# EAGLE design PygmyETX_v1p01 (EAGLE 5.11)

## Sheet 1 of 5
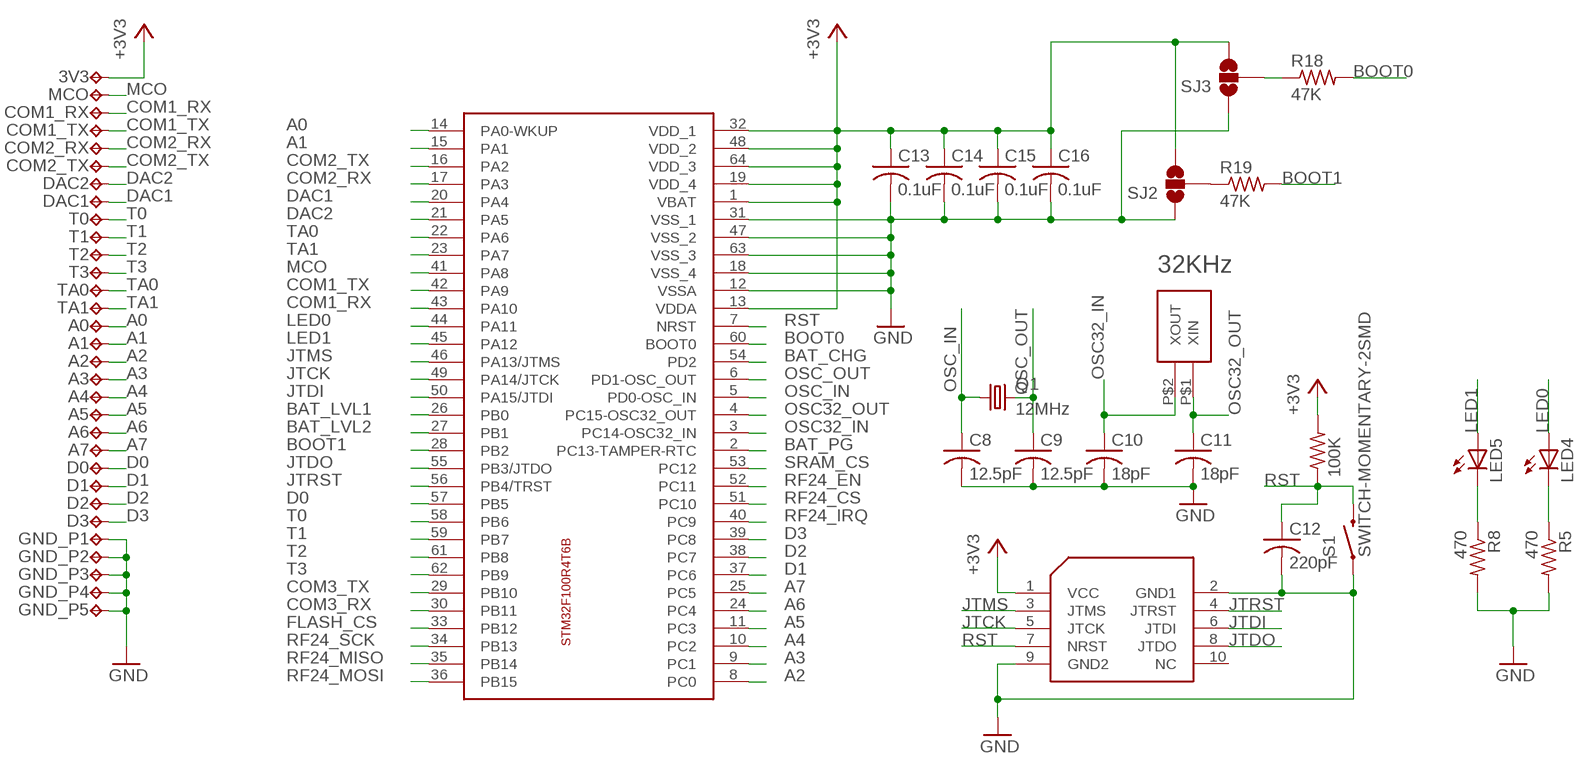
[diagram p0: schematic, sheet 1]

### Parts
3V3  TESTPAD_TPTESTPAD_PTH_STD  [TESTPAD_PTH_STD]
A0  TESTPAD_TPTESTPAD_PTH_STD  [TESTPAD_PTH_STD]
A1  TESTPAD_TPTESTPAD_PTH_STD  [TESTPAD_PTH_STD]
A2  TESTPAD_TPTESTPAD_PTH_STD  [TESTPAD_PTH_STD]
A3  TESTPAD_TPTESTPAD_PTH_STD  [TESTPAD_PTH_STD]
A4  TESTPAD_TPTESTPAD_PTH_STD  [TESTPAD_PTH_STD]
A5  TESTPAD_TPTESTPAD_PTH_STD  [TESTPAD_PTH_STD]
A6  TESTPAD_TPTESTPAD_PTH_STD  [TESTPAD_PTH_STD]
A7  TESTPAD_TPTESTPAD_PTH_STD  [TESTPAD_PTH_STD]
C8  12.5pF  C-USC0402  [C0402]
C9  12.5pF  C-USC0402  [C0402]
C10  18pF  C-USC0402  [C0402]
C11  18pF  C-USC0402  [C0402]
C12  220pF  C-USC0402  [C0402]
C13  0.1uF  C-USC0402  [C0402]
C14  0.1uF  C-USC0402  [C0402]
C15  0.1uF  C-USC0402  [C0402]
C16  0.1uF  C-USC0402  [C0402]
COM1_RX  TESTPAD_TPTESTPAD_PTH_STD  [TESTPAD_PTH_STD]
COM1_TX  TESTPAD_TPTESTPAD_PTH_STD  [TESTPAD_PTH_STD]
COM2_RX  TESTPAD_TPTESTPAD_PTH_STD  [TESTPAD_PTH_STD]
COM2_TX  TESTPAD_TPTESTPAD_PTH_STD  [TESTPAD_PTH_STD]
D0  TESTPAD_TPTESTPAD_PTH_STD  [TESTPAD_PTH_STD]
D1  TESTPAD_TPTESTPAD_PTH_STD  [TESTPAD_PTH_STD]
D2  TESTPAD_TPTESTPAD_PTH_STD  [TESTPAD_PTH_STD]
D3  TESTPAD_TPTESTPAD_PTH_STD  [TESTPAD_PTH_STD]
DAC1  TESTPAD_TPTESTPAD_PTH_STD  [TESTPAD_PTH_STD]
DAC2  TESTPAD_TPTESTPAD_PTH_STD  [TESTPAD_PTH_STD]
GND_P1  TESTPAD_TPTESTPAD_PTH_STD  [TESTPAD_PTH_STD]
GND_P2  TESTPAD_TPTESTPAD_PTH_STD  [TESTPAD_PTH_STD]
GND_P3  TESTPAD_TPTESTPAD_PTH_STD  [TESTPAD_PTH_STD]
GND_P4  TESTPAD_TPTESTPAD_PTH_STD  [TESTPAD_PTH_STD]
GND_P5  TESTPAD_TPTESTPAD_PTH_STD  [TESTPAD_PTH_STD]
LED4  LED0603  [LED-0603]
LED5  LED0603  [LED-0603]
MCO  TESTPAD_TPTESTPAD_PTH_STD  [TESTPAD_PTH_STD]
Q1  12MHz  CRYSTAL5X3  [CRYSTAL-SMD-5X3]
Q2  CM415  [CM415]
R3  100K  R-US_R0402  [R0402]
R5  470  R-US_R0402  [R0402]
R8  470  R-US_R0402  [R0402]
R18  47K  R-US_R0402  [R0402]
R19  47K  R-US_R0402  [R0402]
S1  SWITCH-MOMENTARY-2SMD  [TACTILE_SWITCH_SMD]
SJ2  SOLDERJUMPER_2WAYPASTE1&2  [SJ_3_PASTE1&2]
SJ3  SOLDERJUMPER_2WAYPASTE1&2  [SJ_3_PASTE1&2]
T0  TESTPAD_TPTESTPAD_PTH_STD  [TESTPAD_PTH_STD]
T1  TESTPAD_TPTESTPAD_PTH_STD  [TESTPAD_PTH_STD]
T2  TESTPAD_TPTESTPAD_PTH_STD  [TESTPAD_PTH_STD]
T3  TESTPAD_TPTESTPAD_PTH_STD  [TESTPAD_PTH_STD]
TA0  TESTPAD_TPTESTPAD_PTH_STD  [TESTPAD_PTH_STD]
TA1  TESTPAD_TPTESTPAD_PTH_STD  [TESTPAD_PTH_STD]
U3  STM32F100R4T6B  [S-PQFP64-G64]
U$1  STM32-JTAG-10P  [STM32-JTAG-10P]

### Nets
+3V3: 3V3.P$1(TP) C13.1 C14.1 C15.1 C16.1 R3.2 SJ2.3 SJ3.3 U3.1(VBAT) U3.13(VDDA) U3.19(VDD_4) U3.32(VDD_1) U3.48(VDD_2) U3.64(VDD_3) U$1.1(VCC) ; also sheet 2,3,5
A0: A0.P$1(TP) U3.14(PA0-WKUP)
A1: A1.P$1(TP) U3.15(PA1)
A2: A2.P$1(TP) U3.8(PC0)
A3: A3.P$1(TP) U3.9(PC1)
A4: A4.P$1(TP) U3.10(PC2)
A5: A5.P$1(TP) U3.11(PC3)
A6: A6.P$1(TP) U3.24(PC4)
A7: A7.P$1(TP) U3.25(PC5)
BAT_CHG: U3.54(PD2) ; also sheet 3
BAT_LVL1: U3.26(PB0) ; also sheet 3
BAT_LVL2: U3.27(PB1) ; also sheet 3
BAT_PG: U3.2(PC13-TAMPER-RTC) ; also sheet 3
BOOT0: R18.2 U3.60(BOOT0)
BOOT1: R19.2 U3.28(PB2)
COM1_RX: COM1_RX.P$1(TP) U3.43(PA10)
COM1_TX: COM1_TX.P$1(TP) U3.42(PA9)
COM2_RX: COM2_RX.P$1(TP) U3.17(PA3)
COM2_TX: COM2_TX.P$1(TP) U3.16(PA2)
COM3_RX: U3.30(PB11) ; also sheet 4
COM3_TX: U3.29(PB10) ; also sheet 4
D0: D0.P$1(TP) U3.57(PB5)
D1: D1.P$1(TP) U3.37(PC6)
D2: D2.P$1(TP) U3.38(PC7)
D3: D3.P$1(TP) U3.39(PC8)
DAC1: DAC1.P$1(TP) U3.20(PA4)
DAC2: DAC2.P$1(TP) U3.21(PA5)
FLASH_CS: U3.33(PB12) ; also sheet 5
GND: C8.2 C9.2 C10.2 C11.2 C12.2 C13.2 C14.2 C15.2 C16.2 GND_P1.P$1(TP) GND_P2.P$1(TP) GND_P3.P$1(TP) GND_P4.P$1(TP) GND_P5.P$1(TP) R5.2 R8.2 S1.1 SJ2.1 SJ3.1 U3.12(VSSA) U3.18(VSS_4) U3.31(VSS_1) U3.47(VSS_2) U3.63(VSS_3) U$1.2(GND1) U$1.9(GND2) ; also sheet 2,3,4,5
JTCK: U3.49(PA14/JTCK) U$1.5(JTCK)
JTDI: U3.50(PA15/JTDI) U$1.6(JTDI)
JTDO: U3.55(PB3/JTDO) U$1.8(JTDO)
JTMS: U3.46(PA13/JTMS) U$1.3(JTMS)
JTRST: U3.56(PB4/TRST) U$1.4(JTRST)
LED0: LED4.A U3.44(PA11)
LED1: LED5.A U3.45(PA12)
MCO: MCO.P$1(TP) U3.41(PA8)
N$31: R18.1 SJ3.2
N$33: R19.1 SJ2.2
N$35: LED5.C R8.1
N$37: LED4.C R5.1
OSC32_IN: C10.1 Q2.P$2(XOUT) U3.3(PC14-OSC32_IN)
OSC32_OUT: C11.1 Q2.P$1(XIN) U3.4(PC15-OSC32_OUT)
OSC_IN: C8.1 Q1.1 U3.5(PD0-OSC_IN)
OSC_OUT: C9.1 Q1.3 U3.6(PD1-OSC_OUT)
RF24_CS: U3.51(PC10) ; also sheet 2
RF24_EN: U3.52(PC11) ; also sheet 2
RF24_IRQ: U3.40(PC9) ; also sheet 2
RF24_MISO: U3.35(PB14) ; also sheet 2,5
RF24_MOSI: U3.36(PB15) ; also sheet 2,5
RF24_SCK: U3.34(PB13) ; also sheet 2,5
RST: C12.1 R3.1 S1.3 U3.7(NRST) U$1.7(NRST)
SRAM_CS: U3.53(PC12) ; also sheet 5
T0: T0.P$1(TP) U3.58(PB6)
T1: T1.P$1(TP) U3.59(PB7)
T2: T2.P$1(TP) U3.61(PB8)
T3: T3.P$1(TP) U3.62(PB9)
TA0: TA0.P$1(TP) U3.22(PA6)
TA1: TA1.P$1(TP) U3.23(PA7)
Unconnected: U$1.10(NC)

## Sheet 2 of 5
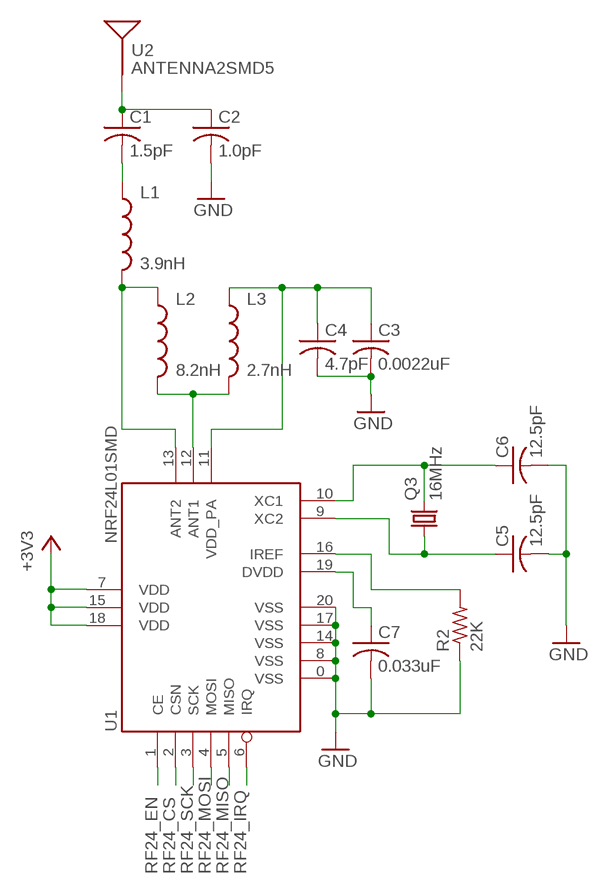
[diagram p1: schematic, sheet 2]

### Parts
C1  1.5pF  C-USC0402  [C0402]
C2  1.0pF  C-USC0402  [C0402]
C3  0.0022uF  C-USC0402  [C0402]
C4  4.7pF  C-USC0402  [C0402]
C5  12.5pF  C-USC0402  [C0402]
C6  12.5pF  C-USC0402  [C0402]
C7  0.033uF  C-USC0402  [C0402]
L1  3.9nH  INDUCTOR0402  [C0402]
L2  8.2nH  INDUCTOR0402  [C0402]
L3  2.7nH  INDUCTOR0402  [C0402]
Q3  16MHz  CRYSTAL5X3  [CRYSTAL-SMD-5X3]
R2  22K  R-US_R0402  [R0402]
U1  NRF24L01SMD  [QFN20]
U2  ANTENNA2SMD5  [ANTENNA-CHIP5]

### Nets
+3V3: U1.7(VDD) U1.15(VDD) U1.18(VDD) ; also sheet 1,3,5
GND: C2.2 C3.2 C4.2 C5.2 C6.2 C7.2 R2.1 U1.0(VSS) U1.8(VSS) U1.14(VSS) U1.17(VSS) U1.20(VSS) ; also sheet 1,3,4,5
N$1: C1.1 C2.1 U2.FEED(SIGNAL)
N$2: C1.2 L1.1
N$3: L1.2 L2.1 U1.13(ANT2)
N$4: L2.2 L3.2 U1.12(ANT1)
N$5: C3.1 C4.1 L3.1 U1.11(VDD_PA)
N$7: C6.1 Q3.3 U1.10(XC1)
N$8: C5.1 Q3.1 U1.9(XC2)
N$10: R2.2 U1.16(IREF)
N$11: C7.1 U1.19(DVDD)
RF24_CS: U1.2(CSN) ; also sheet 1
RF24_EN: U1.1(CE) ; also sheet 1
RF24_IRQ: U1.6(IRQ) ; also sheet 1
RF24_MISO: U1.5(MISO) ; also sheet 1,5
RF24_MOSI: U1.4(MOSI) ; also sheet 1,5
RF24_SCK: U1.3(SCK) ; also sheet 1,5

## Sheet 3 of 5
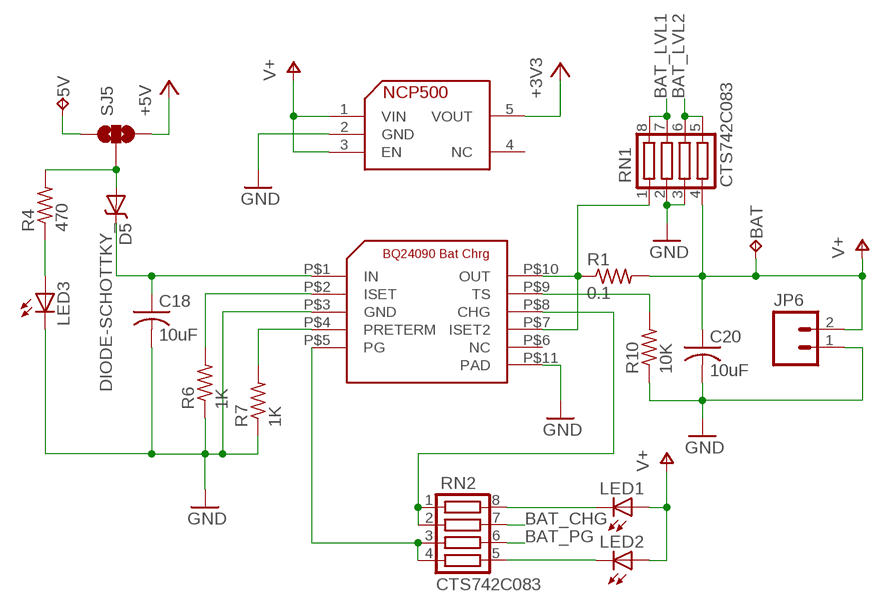
[diagram p2: schematic, sheet 3]

### Parts
5V  TESTPAD_TPTESTPAD_PTH_STD  [TESTPAD_PTH_STD]
BAT  TESTPAD_TPTESTPAD_PTH_STD  [TESTPAD_PTH_STD]
C18  10uF  C-USC1206  [C1206]
C20  10uF  C-USC1206  [C1206]
D5  DIODE-SCHOTTKY_  [SMA-DIODE]
JP6  M02-JST-2MM-SMT  [JST-2-SMD]
LED1  LED0603  [LED-0603]
LED2  LED0603  [LED-0603]
LED3  LED0603  [LED-0603]
R1  0.1  R-US_R0805  [R0805]
R4  470  R-US_R0402  [R0402]
R6  1K  R-US_R0402  [R0402]
R7  1K  R-US_R0402  [R0402]
R10  10K  R-US_R0402  [R0402]
RN1  CTS742C083  [CTS742C083]
RN2  CTS742C083  [CTS742C083]
SJ5  SOLDERJUMPER_2WAYPASTE1&2  [SJ_3_PASTE1&2]
U6  BQ24090  [R-PDSO-G10]
U8  NCP500  [SOT23-5L]

### Nets
+3V3: U8.5(VOUT) ; also sheet 1,2,5
+5V: SJ5.3 ; also sheet 4
BAT_CHG: RN2.7 ; also sheet 1
BAT_LVL1: RN1.7 RN1.8 ; also sheet 1
BAT_LVL2: RN1.5 RN1.6 ; also sheet 1
BAT_PG: RN2.6 ; also sheet 1
GND: C18.2 C20.2 JP6.1 LED3.C R6.1 R7.1 R10.1 RN1.2 RN1.3 U6.P$3(GND) U6.P$11(PAD) U8.2(GND) ; also sheet 1,2,4,5
N$6: C18.1 D5.C U6.P$1(IN)
N$9: 5V.P$1(TP) SJ5.1
N$12: R6.2 U6.P$2(ISET)
N$13: R7.2 U6.P$4(PRETERM)
N$14: RN2.3 RN2.4 U6.P$5(PG)
N$15: LED3.A R4.1
N$16: R1.1 RN1.1 U6.P$7(ISET2) U6.P$10(OUT)
N$17: RN2.1 RN2.2 U6.P$8(CHG)
N$18: R10.2 U6.P$9(TS)
N$20: LED2.C RN2.5
N$23: LED1.C RN2.8
N$25: D5.A R4.2 SJ5.2
V+: BAT.P$1(TP) C20.1 JP6.2 LED1.A LED2.A R1.2 RN1.4 U8.1(VIN) U8.3(EN)
Unconnected: U6.P$6(NC) U8.4(NC)

## Sheet 4 of 5
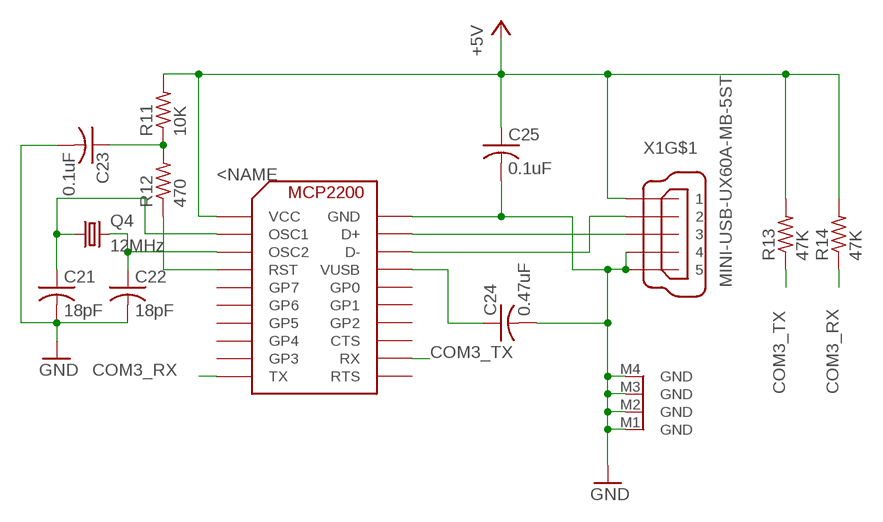
[diagram p3: schematic, sheet 4]

### Parts
C21  18pF  C-USC0402  [C0402]
C22  18pF  C-USC0402  [C0402]
C23  0.1uF  C-USC0402  [C0402]
C24  0.47uF  C-USC0402  [C0402]
C25  0.1uF  C-USC0402  [C0402]
Q4  12MHz  CRYSTAL5X3  [CRYSTAL-SMD-5X3]
R11  10K  R-US_R0402  [R0402]
R12  470  R-US_R0402  [R0402]
R13  47K  R-US_R0402  [R0402]
R14  47K  R-US_R0402  [R0402]
U7  MICROCHIP-USB-MCP2200  [QFN-20-5X5]
X1  MINI-USB-UX60A-MB-5ST  [UX60A-MB-5ST]

### Nets
+5V: C25.1 R11.2 R13.2 R14.2 U7.P18(VCC) X1.1 ; also sheet 3
COM3_RX: R14.1 U7.P7(TX) ; also sheet 1
COM3_TX: R13.1 U7.P9(RX) ; also sheet 1
GND: C21.2 C22.2 C23.2 C24.2 C25.2 U7.P17(GND) X1.4 X1.5 X1.M1(GND) X1.M2(GND) X1.M3(GND) X1.M4(GND) ; also sheet 1,2,3,5
N$19: C23.1 R11.1 R12.2
N$21: C22.1 Q4.3 U7.P20(OSC2)
N$22: C21.1 Q4.1 U7.P19(OSC1)
N$24: R12.1 U7.P1(RST)
N$26: U7.P15(D-) X1.2
N$28: C24.1 U7.P14(VUSB)
N$36: U7.P16(D+) X1.3
Unconnected: U7.P2(GP7) U7.P3(GP6) U7.P4(GP5) U7.P5(GP4) U7.P6(GP3) U7.P8(RTS) U7.P10(CTS) U7.P11(GP2) U7.P12(GP1) U7.P13(GP0)

## Sheet 5 of 5
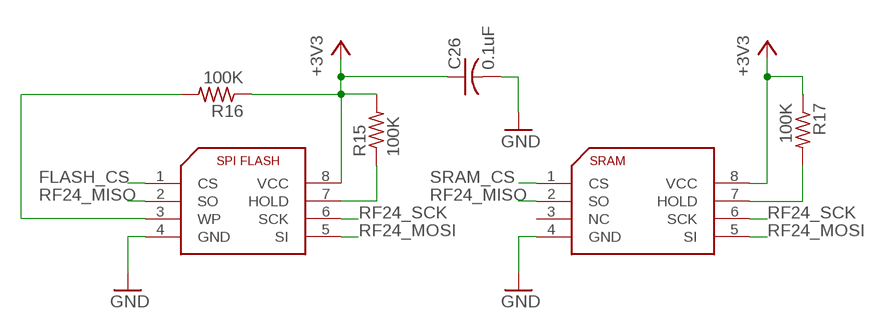
[diagram p4: schematic, sheet 5]

### Parts
C26  0.1uF  C-USC0402  [C0402]
R15  100K  R-US_R0402  [R0402]
R16  100K  R-US_R0402  [R0402]
R17  100K  R-US_R0402  [R0402]
U9  SST25VF080B  [SOIC8]
U10  N25S0830HA  [TSSOP8]

### Nets
+3V3: C26.1 R15.2 R16.1 R17.1 U9.8(VCC) U10.8(VCC) ; also sheet 1,2,3
FLASH_CS: U9.1(CS) ; also sheet 1
GND: C26.2 U9.4(GND) U10.4(GND) ; also sheet 1,2,3,4
N$27: R17.2 U10.7(HOLD)
N$30: R16.2 U9.3(WP)
N$32: R15.1 U9.7(HOLD)
RF24_MISO: U9.2(SO) U10.2(SO) ; also sheet 1,2
RF24_MOSI: U9.5(SI) U10.5(SI) ; also sheet 1,2
RF24_SCK: U9.6(SCK) U10.6(SCK) ; also sheet 1,2
SRAM_CS: U10.1(CS) ; also sheet 1
Unconnected: U10.3(NC)

## Library data of the parts
3V3 5V A0 A1-A7 BAT COM1_RX COM1_TX COM2_RX COM2_TX D0 D1-D3 DAC1 DAC2 GND_P1-GND_P5 MCO T0 T1-T3 TA0 TA1 = Pygmy:TESTPAD_TP: Test pad
C1-C16 C18 C20-C26 = rcl:C-US: CAPACITOR, American symbol
D5 = SparkFun:DIODE-SCHOTTKY
JP6 = SparkFun:M02: Header 2 Standard 2-pin 0.1" header. Use with straight break away headers (SKU : PRT-00116), right angle break away headers (PRT-00553), swiss pins (PRT-00743), machine pins (PRT-00117), and female headers (PRT-00115). Molex polarized connector foot print use with SKU : PRT-08233 with associated crimp pins and housings.
L1-L3 = SparkFun:INDUCTOR: Inductors Basic Inductor/Choke - 0603 and 1206. Footprints are not proven and vary greatly between part numbers.
LED1-LED5 = SparkFun:LED: LEDs Standard schematic elements and footprints for 5mm, 3mm, 1206, and 0603 sized LEDs. 5mm - Spark Fun Electronics SKU : COM-00529 (and others)
Q1 Q3 Q4 = SparkFun:CRYSTAL: Crystals Various standard crystals. Proven footprints. Spark Fun Electronics SKU : COM-00534
Q2 = dublib:CM415
R1-R8 R10-R19 = rcl:R-US_: RESISTOR, American symbol
RN1 RN2 = resistor-net:CTS742C083: Chip Resistor Array 4 Single Resistor Source: http://www.ctscorp.com/components/Datasheets/CTSChipArrayDs.pdf; OC_FARNELL: unknown; OC_NEWARK: unknown
S1 = SparkFun:SWITCH-MOMENTARY-2
SJ2 SJ3 = SparkFun:SOLDERJUMPER_2WAY: Solder Jumper 2 way solder jumper
SJ5 = Pygmy:SOLDERJUMPER_2WAY: Solder Jumper 2 way solder jumper
U1 = SparkFun:NRF24L01: 2.4GHz Low Power Transceiver This is the very popular, low cost, very low power RF transceiver from Nordic Semiconductor. Simple SPI interface. SKU: COM-00690
U2 = SparkFun:ANTENNA2: Antenna Single endded antenna. Common with smaller chip antennas. CHIP4 package is the GPS Chip Antenna SKU: GPS-08418. CHIP5 package is 2.4GHz chip antenna SKU: WRL-00144.
U3 = dublib:STM32F100R4T6B
U6 = dublib:BQ24090
U7 = dublib:MICROCHIP-USB-MCP2200
U8 = dublib:NCP500
U9 = dublib:SST25VF080B
U10 = dublib:N25S0830HA
U$1 = Pygmy:STM32-JTAG-10P
X1 = dublib:MINI-USB-: MINI USB Connector Source: http://www.hirose.co.jp/cataloge_hp/e24000019.pdf

## Board
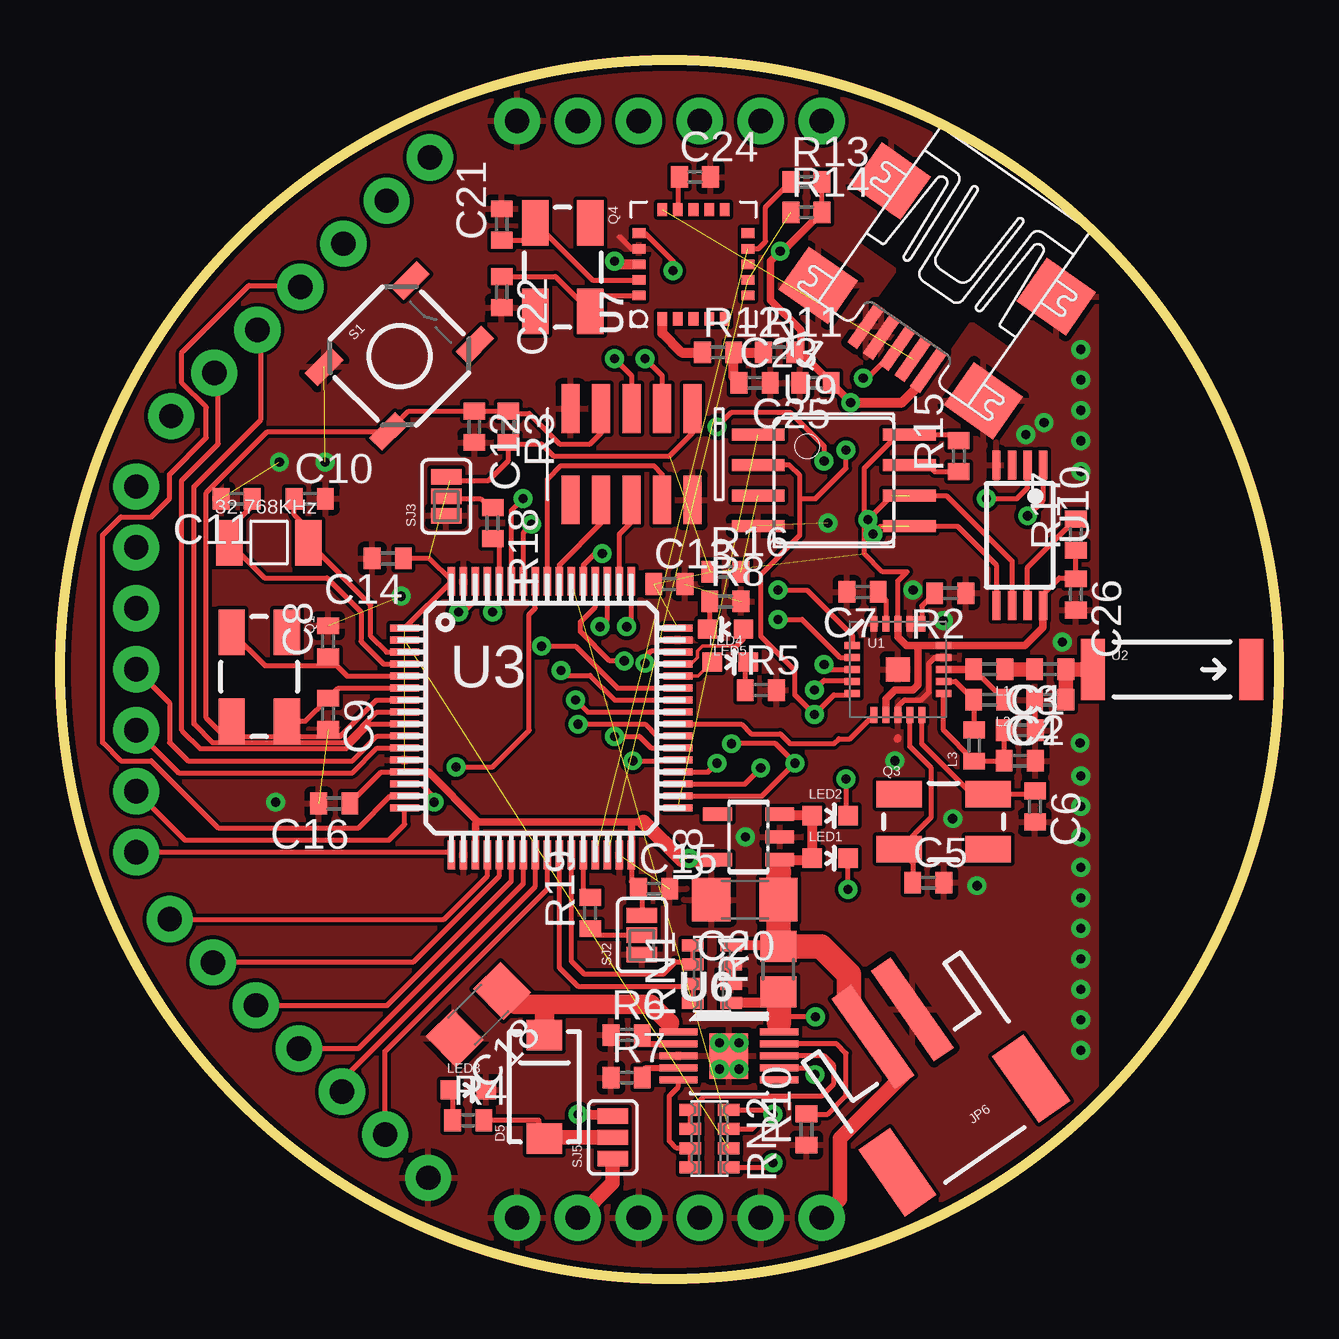
[diagram p5: board, top side]
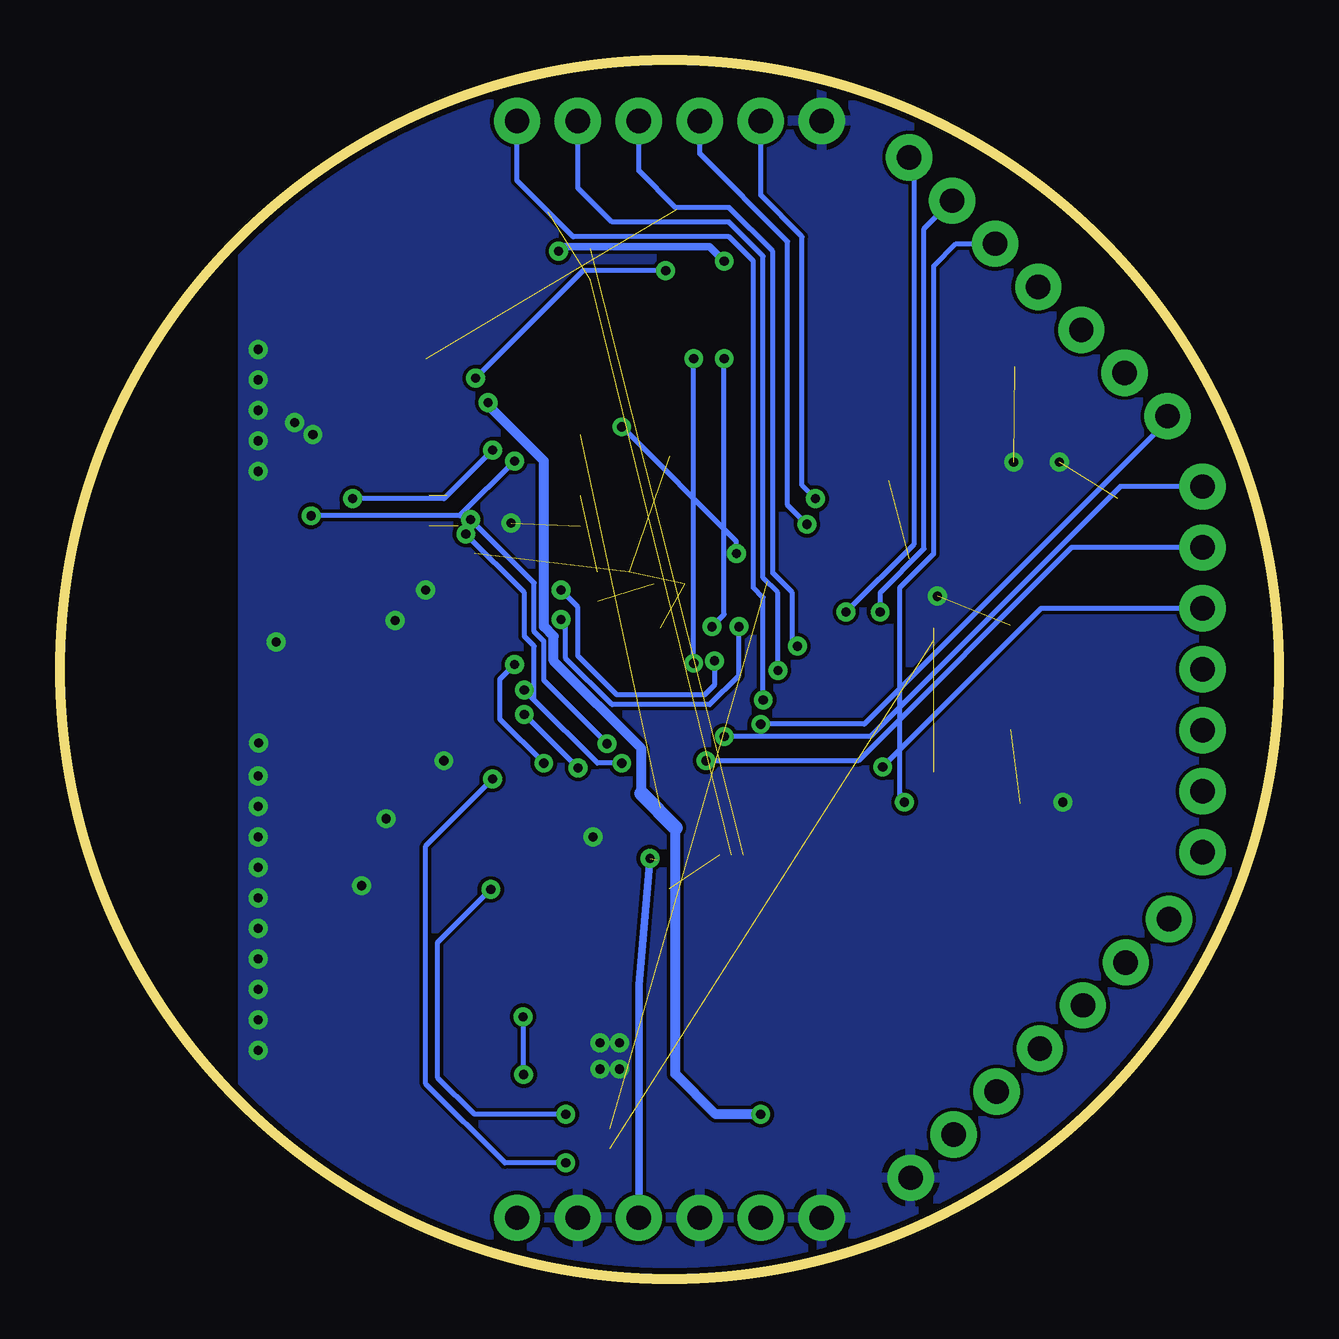
[diagram p6: board, bottom side, seen from below]

Size 50.8 x 50.8 mm. Coordinates in mm from the lower left corner, seen from the top.
Outline: circle at 25.4,25.4 radius 25.4
Copper layers (1*16): Top 0.035mm / dielectric 1.5mm / Bottom 0.035mm
Design rules "PDX (Production)": minimum track width 6mil, minimum drill 15mil, track to track 6mil, track to pad 6mil, pad to pad 4mil, via to via 6mil, smd to smd 4mil, copper to edge 10mil, drill to drill 6mil, minimum pad ring 10mil, minimum via ring 8mil, stop-mask expansion 4mil, vias tented up to drill 25mil, thermal gap 10mil

### Footprints (pad centres in the part's own frame; a part is rotated, then mirrored left to right if it is on the bottom)
TESTPAD_PTH_STD = drill 1.016 pad 1.93 round: P$1 0,0
C0402 = smd 0.7 x 0.9: 1 -0.65,0; 2 0.65,0
C1206 = smd 1.6 x 1.8: 1 -1.4,0; 2 1.4,0
SMA-DIODE = smd 1.27 x 1.47: A -2.15,0; C 2.15,0
JST-2-SMD = smd 1 x 4.6: 1 -1,-3.7; 2 1,-3.7 | smd 1.6 x 3.4: NC1 -3.4,1.5; NC2 3.4,1.5
LED-0603 = smd 0.8 x 0.8: A 0,-0.75; C 0,0.75
CRYSTAL-SMD-5X3 = smd 1.9 x 1.1: 1 -1.85,-1.15; 2 1.85,-1.15; 3 1.85,1.15; 4 -1.85,1.15
CM415 = smd 1.1 x 1.9: P$1 0,0; P$2 3.3,0
R0805 = smd 1.3 x 1.5: 1 -0.95,0; 2 0.95,0
R0402 = smd 0.7 x 0.9: 1 -0.65,0; 2 0.65,0
CTS742C083 = smd 0.5 x 0.9: 1 -1.2,-0.8; 2 -0.4,-0.8; 3 0.4,-0.8; 4 1.2,-0.8; 5 1.2,0.8; 6 0.4,0.8; 7 -0.4,0.8; 8 -1.2,0.8
TACTILE_SWITCH_SMD = smd 1.524 x 0.762: 1 -2.54,1.905; 2 2.54,1.905; 3 -2.54,-1.905; 4 2.54,-1.905
SJ_3_PASTE1&2 = smd 0.635 x 1.27: 1 -0.813,0; 2 0,0; 3 0.813,0
SJ_3_PASTE1&2' = smd 0.635 x 1.27: 1 -0.889,0; 2 0,0; 3 0.889,0
QFN20 = smd 1 x 1: 0 0,0 | smd 0.65 x 0.3: 1 -1.9,1; 2 -1.9,0.5; 3 -1.9,0; 4 -1.9,-0.5; 5 -1.9,-1; 11 1.9,-1; 12 1.9,-0.5; 13 1.9,0; 14 1.9,0.5; 15 1.9,1 | smd 0.3 x 0.65: 6 -1,-1.9; 7 -0.5,-1.9; 8 0,-1.9; 9 0.5,-1.9; 10 1,-1.9; 16 1,1.9; 17 0.5,1.9; 18 0,1.9; 19 -0.5,1.9; 20 -1,1.9
ANTENNA-CHIP5 = smd 1.016 x 2.54: FEED -3.302,0; NC 3.302,0
S-PQFP64-G64 = smd 1.2 x 0.3: 1 -5.7,3.75; 2 -5.7,3.25; 3 -5.7,2.75; 4 -5.7,2.25; 5 -5.7,1.75; 6 -5.7,1.25; 7 -5.7,0.75; 8 -5.7,0.25; 9 -5.7,-0.25; 10 -5.7,-0.75; 11 -5.7,-1.25; 12 -5.7,-1.75; 13 -5.7,-2.25; 14 -5.7,-2.75; 15 -5.7,-3.25; 16 -5.7,-3.75; 33 5.7,-3.75; 34 5.7,-3.25; 35 5.7,-2.75; 36 5.7,-2.25; 37 5.7,-1.75; 38 5.7,-1.25; 39 5.7,-0.75; 40 5.7,-0.25; 41 5.7,0.25; 42 5.7,0.75; 43 5.7,1.25; 44 5.7,1.75; 45 5.7,2.25; 46 5.7,2.75; 47 5.7,3.25; 48 5.7,3.75 | smd 0.3 x 1.2: 17 -3.75,-5.7; 18 -3.25,-5.7; 19 -2.75,-5.7; 20 -2.25,-5.7; 21 -1.75,-5.7; 22 -1.25,-5.7; 23 -0.75,-5.7; 24 -0.25,-5.7; 25 0.25,-5.7; 26 0.75,-5.7; 27 1.25,-5.7; 28 1.75,-5.7; 29 2.25,-5.7; 30 2.75,-5.7; 31 3.25,-5.7; 32 3.75,-5.7; 49 3.75,5.7; 50 3.25,5.7; 51 2.75,5.7; 52 2.25,5.7; 53 1.75,5.7; 54 1.25,5.7; 55 0.75,5.7; 56 0.25,5.7; 57 -0.25,5.7; 58 -0.75,5.7; 59 -1.25,5.7; 60 -1.75,5.7; 61 -2.25,5.7; 62 -2.75,5.7; 63 -3.25,5.7; 64 -3.75,5.7
R-PDSO-G10 = smd 0.3 x 1.6: P$1 0,0; P$2 0.5,0; P$3 1,0; P$4 1.5,0; P$5 2,0; P$6 2,4.2; P$7 1.5,4.2; P$8 1,4.2; P$9 0.5,4.2; P$10 0,4.2 | smd 1.9 x 1.6: P$11 1,2.1
QFN-20-5X5 = smd 0.55 x 0.4: P1 0,-0.975; P2 0,-1.625; P3 0,-2.275; P4 0,-2.925; P5 0,-3.575; P11 4.55,-3.575; P12 4.55,-2.925; P13 4.55,-2.275; P14 4.55,-1.625; P15 4.55,-0.975 | smd 0.4 x 0.55: P6 0.975,-4.55; P7 1.625,-4.55; P8 2.275,-4.55; P9 2.925,-4.55; P10 3.575,-4.55; P16 3.575,0; P17 2.925,0; P18 2.275,0; P19 1.625,0; P20 0.975,0
SOT23-5L = smd 0.55 x 1.2: 1 -0.95,-1.3; 2 0,-1.3; 3 0.95,-1.3; 4 0.95,1.3; 5 -0.95,1.3
SOIC8@1 = smd 0.5 x 2.2: 1 -1.905,-3.154; 2 -0.645,-3.154; 3 0.625,-3.154; 4 1.895,-3.154; 5 1.905,3.154; 6 0.635,3.154; 7 -0.635,3.154; 8 -1.905,3.154
TSSOP8 = smd 1.2 x 0.35: 1 -2.925,0.975; 2 -2.925,0.325; 3 -2.925,-0.325; 4 -2.925,-0.975; 5 2.925,-0.975; 6 2.925,-0.325; 7 2.925,0.325; 8 2.925,0.975
STM32-JTAG-10P = smd 0.762 x 2.032: 1 0,0; 2 0,3.81; 3 1.27,0; 4 1.27,3.81; 5 2.54,0; 6 2.54,3.81; 7 3.81,0; 8 3.81,3.81; 9 5.08,0; 10 5.08,3.81
UX60A-MB-5ST = smd 2 x 0.5: 1 2.25,1.6; 2 2.25,0.8; 3 2.25,0; 4 2.25,-0.8; 5 2.25,-1.6 | smd 2.2 x 2.5: M1 -3.3,-4.2; M2 -3.3,4.2; M3 2,4.2; M4 2,-4.2

### Placement (x,y rotation side)
3V3  26.67,2.54 0 top
5V  21.59,2.54 0 top
A0  11.82,43.14 270 top
A1  10.02,41.35 270 top
A2  8.23,39.55 270 top
A3  6.43,37.75 270 top
A4  3.17,25.4 135 top
A5  3.17,22.86 135 top
A6  11.75,7.8 135 top
A7  13.55,6 135 top
BAT  31.75,2.54 0 top
C1  41.27,25.4 180 top
C2  41.27,24.13 180 top
C3  40,22.86 0 top
C4  40,21.59 0 top
C5  36.2,16.51 0 top
C6  40.64,19.68 270 top
C7  33.45,28.63 180 top
C8  11.18,26.57 90 top
C9  11.18,23.55 270 top
C10  10.41,32.51 0 top
C11  7.37,32.51 180 top
C12  17.27,35.51 270 top
C13  25.4,28.96 0 top
C14  13.67,30.02 180 top
C15  24.76,16.26 0 top
C16  11.43,19.81 180 top
C18  17.44,11.01 225 top
C20  28.55,15.8 180 top
C21  18.41,43.94 90 top
C22  18.41,41.12 270 top
C23  28.96,37.34 0 top
C24  26.47,45.92 0 top
C25  31.5,37.34 180 top
C26  42.34,28.52 270 top
COM1_RX  26.67,48.26 0 top
COM1_TX  29.21,48.26 0 top
COM2_RX  3.17,17.78 0 top
COM2_TX  3.17,20.32 0 top
D0  3.17,27.94 0 top
D1  3.17,30.48 0 top
D2  3.17,33.02 0 top
D3  4.63,35.96 270 top
D5  20.19,8 90 top
DAC1  4.57,14.99 0 top
DAC2  6.38,13.18 0 top
GND_P1  19.05,2.54 0 top
GND_P2  29.21,2.54 0 top
GND_P3  19.05,48.26 0 top
GND_P4  15.35,4.21 90 top
GND_P5  24.13,2.54 0 top
JP6  36.83,7.62 215 top
L1  38.73,25.4 180 top
L2  38.73,24.13 180 top
L3  38.1,22.22 90 top
LED1  32.11,17.53 270 top
LED2  32.11,19.3 270 top
LED3  17.02,7.87 270 top
LED4  27.94,25.7 270 top
LED5  27.74,27.08 90 top
MCO  31.75,48.26 0 top
Q1  8.31,25.1 270 top
Q2  7.06,30.68 0 top
Q3  36.83,19.05 0 top
Q4  20.95,42.16 270 top
R1  29.95,12.9 90 top
R2  37.11,28.57 180 top
R3  18.69,35.51 270 top
R4  17.02,6.6 0 top
R5  29.21,24.54 0 top
R6  23.62,10.16 0 top
R7  23.62,8.38 0 top
R8  27.74,28.23 0 top
R10  31.12,6.22 90 top
R11  29.97,38.61 0 top
R12  27.43,38.61 0 top
R13  31.12,45.72 0 top
R14  31.12,44.45 0 top
R15  37.46,34.29 90 top
R16  27.74,29.46 0 top
R17  42.34,31.01 90 top
R18  18.03,31.5 270 top
R19  22.1,15.24 90 top
RN1  27.18,12.7 90 top
RN2  27.08,5.84 270 top
S1  14.15,38.46 45 top
SJ2  24.26,14.33 90 top
SJ3  16.1,32.61 90 top
SJ5  [SJ_3_PASTE1&2']  23.04,5.89 90 top
T0  24.13,48.26 0 top
T1  21.59,48.26 0 top
T2  15.41,46.73 270 top
T3  13.61,44.94 270 top
TA0  8.16,11.39 135 top
TA1  9.96,9.6 135 top
U1  34.92,25.4 0 top
U2  46.35,25.4 0 top
U3  20.07,23.37 0 top
U6  25.78,10.29 270 top
U7  24.13,40 90 top
U8  28.7,18.41 90 top
U9  SST25VF080B  [SOIC8@1]  32.26,33.27 270 top
U10  40,30.99 270 top
U$1  26.37,36.27 180 top
X1  36.2,40.64 235 top

### Tracks (layer width: path | path; a pad name or v marks a point on that pad's centre or on a via)
+3V3  (via drill 0.38)  (7 unrouted)
  Top 0.203: 14.48,30.12 14.38,30.02 C14.1 15.39,30.02 16.32,29.1 U3.64 U3.1 | U1.18 34.92,29.08 35.31,29.46 34.29,29.46 33.53,30.23 33.53,33.78 34.92,35.18 U9.8 | U9.8 35.31,35.07 | U9.8 37.23,35.18 R15.2 | U$1.1 26.37,35.25 25.4,34.29 20.57,34.29 20.07,34.8 18.76,34.8 R3.2 18.69,34.11 17.86,33.27 16.26,33.27 | U3.32 23.82,16.55 C15.1 24.26,16.11 SJ2.3 | U3.13 13.39,21.12 C16.1 | R17.1 C26.1 42.31,29.21 41.66,29.21 40.98,28.53 U10.8
  Top 0.305: U3.19 17.32,18.95 17.41,19.05 17.42,19.05 | 23.93,19.05 23.82,18.94 U3.32 | 23.93,19.05 24.33,19.05 | U1.7 34.42,24.16 34.8,24.54 35.56,24.54 35.76,24.74 35.76,26.4 | U1.15 36.36,26.4 | U1.18 34.92,26.75 35.27,26.4 35.76,26.4 | 35.76,26.4 U1.15 | 17.42,19.05 23.93,19.05 | 17.42,19.05 15.36,21.12 U3.13 | SJ3.3 16.26,33.27 | U1.15 40.22,26.4 40.97,27.15 U10.8
  Top 0.61: U8.5 25.92,17.46 24.33,19.05
  Bottom 0.305: 3V3.P$1 26.67,12.24 v26.21,17.53
+5V  (via drill 0.38)
  Top 0.203: R14.2 R13.2 | 35.92,37.58 X1.1 | 22.78,6.68 SJ5.3 23.19,6.78
  Top 0.305: 30.88,38.61 R11.2 | 30.88,38.61 C25.1 v32.96,36.52 | 30.88,38.61 30.88,39.53 29.62,40.79 29.62,42.42 v30.02,42.82 30.14,42.82 R14.2 31.77,44.36 | 35.92,37.34 35.92,37.58
  Top 0.406: U7.P18 23.25,42.28 v23.11,42.42 | 35.92,37.34 35.1,36.52 v32.96,36.52 | 23.19,6.78 v21.59,6.86
  Bottom 0.203: 32.96,36.41 v32.96,36.52
  Bottom 0.305: v30.02,42.82 29.82,43.03 23.72,43.03 v23.11,42.42
  Bottom 0.406: 25.15,18.8 25.15,8.53 23.47,6.86 v21.59,6.86 | 26.57,20.22 26.57,22.1 30.23,25.76 30.23,26.77 30.63,27.18 30.63,34.09 32.96,36.41
  Bottom 0.61: 25.15,18.8 26.57,20.22
A0  (via drill 0.38)
  Top 0.203: 14.72,20.62 U3.14 15.04,20.62 15.6,20.07 v15.6,19.86
  Bottom 0.203: A0.P$1 13.45,43.14 14.38,42.21 14.38,30.23 15.8,28.8 15.8,20.07 v15.6,19.86
A1
  Top 0.203: U3.15 13.77,20.12 12.45,18.8 6.6,18.8 3.81,21.59 2.54,21.59 1.78,22.35 1.78,30.99 2.54,31.75 3.81,31.75 4.57,32.51 4.57,33.53 6.1,35.05 6.1,36.32 5.08,37.34 5.08,38.61 7.87,41.4 9.96,41.4 A1.P$1
A2
  Top 0.203: U3.8 13.2,23.62 11.94,22.35 6.35,22.35 5.59,23.11 5.59,33.02 8.38,35.81 8.38,39.39 A2.P$1
A3
  Top 0.203: U3.9 12.96,23.12 11.94,22.1 5.84,22.1 5.08,22.86 5.08,33.27 6.6,34.8 6.6,37.58 A3.P$1
A4
  Top 0.203: U3.10 13.22,22.62 12.19,21.59 5.33,21.59 4.57,22.35 4.57,24 A4.P$1
A5
  Top 0.203: U3.11 13.23,22.12 12.19,21.08 4.95,21.08 A5.P$1
A6
  Top 0.203: U3.24 19.82,16.36 11.75,8.3 A6.P$1
A7
  Top 0.203: U3.25 20.32,16.25 13.55,9.49 A7.P$1
BAT_CHG  (1 unrouted)
  Top 0.203: RN2.7 28.85,6.24 28.96,6.35
BAT_LVL1
  Top 0.203: RN1.8 RN1.7 26.27,12.19 21.59,12.19 20.82,12.97 U3.26
BAT_LVL2
  Top 0.203: RN1.5 RN1.6 26.27,13.21 25.65,13.21 25.15,12.7 21.84,12.7 21.32,13.23 U3.27
BAT_PG  (1 unrouted)
BOOT0
  Top 0.203: U3.60 18.32,30.56 R18.2
BOOT1
  Top 0.203: U3.28 21.82,16.17 R19.2
COM1_RX  (via drill 0.38)
  Top 0.203: v20.07,26.37 21.49,26.37 23.24,24.62 U3.43
  Bottom 0.203: COM1_RX.P$1 26.67,46.18 25.15,44.65 22.91,44.65 21.08,42.82 21.08,29.41 20.27,28.6 20.27,26.57 v20.07,26.37
COM1_TX  (via drill 0.38)
  Top 0.203: v20.88,25.35 21.08,25.15 22.1,25.15 23.13,24.12 U3.42
  Bottom 0.203: COM1_TX.P$1 29.21,45.47 27.79,44.04 22.91,44.04 21.49,42.62 21.49,29.21 20.88,28.6 v20.88,25.35
COM2_RX
  Top 0.203: COM2_RX.P$1 16.2,17.78 U3.17
COM2_TX
  Top 0.203: U3.16 14.37,18.94 13.72,18.29 5.21,18.29 COM2_TX.P$1
COM3_RX  (2 unrouted)
COM3_TX  (1 unrouted)
  Top 0.203: U7.P9 29.11,42.93 29.41,43.23 29.41,44.67 R13.1
D0  (via drill 0.38)
  Top 0.203: v16.51,21.34 18.03,21.34 19.56,22.86 19.56,27.69 19.81,27.94 U3.57
  Bottom 0.203: D0.P$1 9.91,27.94 v16.51,21.34
D1  (via drill 0.38)
  Top 0.203: v23.88,21.59 25.74,21.59 U3.37
  Bottom 0.203: D1.P$1 8.64,30.48 17.53,21.59 v23.88,21.59
D2  (via drill 0.38)
  Top 0.203: v23.11,22.61 24.15,22.61 24.64,22.12 U3.38
  Bottom 0.203: D2.P$1 6.6,33.02 17.02,22.61 v23.11,22.61
D3  (via drill 0.38)
  Top 0.203: v21.59,23.11 24.38,23.11 24.89,22.61 25.75,22.61 U3.39
  Bottom 0.203: D3.P$1 4.63,35.75 17.27,23.11 v21.59,23.11
DAC1
  Top 0.203: U3.20 17.82,16.8 16,14.99 DAC1.P$1
DAC2
  Top 0.203: U3.21 18.32,16.79 14.73,13.21 6.4,13.21 DAC2.P$1
FLASH_CS  (1 unrouted)
GND  (via drill 0.38)  (7 unrouted)
  Top 0.203: C3.2 40.66,24.1 C2.2 | U7.P17 23.82,42.93 23.32,43.43 | U1.14 36.47,25.9 36.22,25.65 36.22,24.43 35.92,24.13 35.2,24.13 34.92,23.85 U1.8
  Top 0.305: 34.92,22.53 34.9,22.5
  Top 0.406: RN1.3 RN1.2
  other vias: 38.23,16.38 32,31.5 42.55,36.2 41.78,26.54 42.55,37.46 42.55,34.92 42.55,33.66 9.14,34.04 40.26,35.18 42.55,38.73 41.02,35.69 14.22,28.45 11.05,34.04 34.8,21.59 42.52,22.33 42.55,20.95 42.55,19.68 42.55,18.41 42.55,17.14 42.55,15.88 42.55,14.6 37.21,19.18 42.55,10.79 42.55,12.06 42.55,13.33 42.55,9.52 28.57,18.41 8.99,19.86 35.56,28.7 36.83,27.43 27.48,9.83 28.3,9.83 27.48,8.74 28.3,8.74
  pour Top: -7.62,53.34 43.18,53.34 43.18,-2.54 -7.62,-2.54
  pour Bottom: -10.16,55.88 43.18,55.88 43.18,-5.08 -10.16,-5.08
JTCK  (via drill 0.38)
  Top 0.203: U$1.5 23.82,37.64 v23.11,38.35 | v23.62,27.18 23.8,27.36 23.8,29.05 U3.49
  Bottom 0.203: v23.11,38.35 23.11,27.69 v23.62,27.18
JTDI
  Top 0.203: U3.50 23.32,31.04 23.82,31.55 U$1.6
JTDO
  Top 0.203: U3.55 20.82,29.76 22.55,31.5 U$1.8
JTMS  (via drill 0.38)
  Top 0.203: U$1.3 25.09,37.64 v24.38,38.35 | v24.38,25.65 24.38,25.91 24.64,26.16 25.72,26.16 U3.46
  Bottom 0.203: v24.38,25.65 v24.38,38.35
JTRST
  Top 0.203: U$1.4 25.09,33.53 24.74,33.88 20.88,33.88 20.32,33.32 U3.56
LED0
  Top 0.152: LED4.A 26.6,25.12 U3.44
LED1
  Top 0.152: 28.19,26.37 26.77,26.37 26.57,26.16 26.57,25.89 26.3,25.62 U3.45
  Top 0.203: 28.19,26.37 28.49,26.66 LED5.A
MCO  (via drill 0.38)
  Top 0.203: v21.49,24.13 22,23.62 U3.41
  Bottom 0.203: MCO.P$1 31.75,45.77 29.41,43.43 22.91,43.43 21.89,42.42 21.89,28.8 21.49,28.4 v21.49,24.13
N$1
  Top 0.61: U2.FEED C1.1 C2.1
N$2
  Top 0.61: L1.1 C1.2
N$3
  Top 0.203: 38.09,25.43 L1.2 L2.1
  Top 0.305: U1.13 L1.2
N$4
  Top 0.203: U1.12 37.33,24.9 L2.2 38.09,22.89 L3.2
N$5
  Top 0.203: C3.1 C4.1 39.34,21.57 L3.1 36.82,22.86 U1.11
N$6
  Top 0.203: 25.4,10.67 U6.P$1
  Top 0.813: 25.4,10.67 24.64,11.43 20.2,11.43 | D5.C 20.2,11.43 | 20.2,11.43 19,11.43 C18.1
N$7
  Top 0.203: U1.10 35.92,22.29 37.95,20.27 38.61,20.27 Q3.3 40.5,20.2 C6.1
N$8
  Top 0.203: U1.9 35.42,22.18 36.32,21.29 36.32,19.24 Q3.1 35.55,17.33 C5.1
N$9
  Top 0.61: SJ5.1 23.04,3.99 5V.P$1
N$10
  Top 0.203: U1.16 35.92,28.04 R2.2
N$11
  Top 0.203: U1.19 34.42,28.3 C7.1
N$12
  Top 0.254: U6.P$2 24.14,9.79 R6.2
N$13
  Top 0.254: U6.P$4 24.42,8.79 R7.2
N$14
  Top 0.203: RN2.4 RN2.3 25.7,5.44 25.4,5.74 25.4,7.62 25.78,8 U6.P$5
N$15
  Top 0.203: R4.1 16.37,7.77 LED3.A
N$16  (via drill 0.38)
  Top 0.203: R1.1 29.49,11.75 | U6.P$10 29.98,10.91 29.97,10.67 | U6.P$7 31.19,8.79 v31.47,8.51 | v31.5,10.92 30.23,10.92 29.97,11.18
  Top 0.406: RN1.1 29.24,11.5 29.49,11.75
  Top 1.016: 29.97,10.67 29.97,11.18 29.97,11.93 R1.1
  Bottom 0.203: v31.47,8.51 31.47,10.9 v31.5,10.92
N$17
  Top 0.203: U6.P$8 31.86,9.29 32.26,8.89 32.26,8.13 31.75,7.62 26.85,7.62 RN2.1 RN2.2
N$18
  Top 0.203: U6.P$9 32.38,9.79 32.77,9.4 32.77,7.62 32,6.86 31.13,6.86 R10.2
N$19
  Top 0.406: C23.1 28.08,37.56 R12.2 R11.1
N$20  (via drill 0.38)
  Top 0.203: RN2.5 29.53,4.64 v29.72,4.83 | v32.77,20.83 32.77,19.39 LED2.C
  Bottom 0.203: v29.72,4.83 32.26,4.83 35.56,8.13 35.56,18.03 v32.77,20.83
N$21
  Top 0.203: U7.P20 22.26,40.98 Q4.3 | Q4.3 22.24,39.92 | C22.1 20.65,41.77 Q4.3
N$22
  Top 0.203: U7.P19 22.19,41.63 Q4.1 19.81,43.43 19.67,43.29 C21.1
N$23  (via drill 0.38)
  Top 0.203: RN2.8 29.53,7.04 v29.72,6.86 | v32.84,16.23 32.84,17.51 LED1.C
  Bottom 0.203: v29.72,6.86 33.53,6.86 35.05,8.38 35.05,14.02 v32.84,16.23
N$24
  Top 0.406: U7.P1 25.1,39.41 25.91,38.61 R12.1
N$25
  Top 0.203: R4.2 19.95,6.6 D5.A
  Top 0.61: SJ5.2 20.74,5.89 D5.A
N$26  (1 unrouted)
N$27
  Top 0.203: U10.7 40.33,29.65 R17.2
N$28
  Top 0.203: U7.P14 25.75,45.86 C24.1
N$30  (1 unrouted)
N$31
  Top 0.203: R18.1 17.89,32.15 17.53,32.51 16.2,32.51 SJ3.2
N$32
  Top 0.203: R15.1 36.46,33.64 36.2,33.91 U9.7
N$33
  Top 0.203: SJ2.2 22.36,14.33 R19.1
N$35
  Top 0.203: LED5.C 27.09,27.18 R8.1
N$36  (via drill 0.38)
  Top 0.203: v25.55,42.01 25.55,42.42 24.39,43.58 U7.P16 | X1.3 33.65,37.54 v33.48,37.54
  Bottom 0.203: v33.48,37.54 29.01,42.01 v25.55,42.01
N$37
  Top 0.152: LED4.C 28.62,25.78 28.56,25.78
  Top 0.203: 28.56,25.78 R5.1
OSC32_IN
  Top 0.203: 10.36,31.24 Q2.P$2 12.95,28.09 12.95,26.77 13.61,26.12 U3.3 | 10.36,31.24 10.36,31.53 | C10.1 9.76,31.84 10.36,31.24
OSC32_OUT
  Top 0.203: 7.06,31.24 Q2.P$1 8.53,29.21 11.12,29.21 12.55,27.79 12.55,26.57 13.5,25.62 U3.4 | 7.06,31.24 7.06,31.51 | C11.1 8.02,32.2 7.06,31.24
OSC_IN
  Top 0.203: U3.5 11.98,25.12 11.54,25.56 | 11.54,25.56 C8.1 | Q1.1 8.55,25.55 11.53,25.55 11.54,25.56
OSC_OUT
  Top 0.203: Q1.3 10.22,23.24 C9.1 11.6,24.62 U3.6
RF24_CS  (via drill 0.38)
  Top 0.203: U1.2 32.52,25.9 30.94,27.48 v29.92,27.48 | v22.5,27.18 22.82,27.49 U3.51
  Bottom 0.203: v22.5,27.18 22.5,25.15 23.72,23.93 27.79,23.93 29.72,25.86 29.72,27.28 v29.92,27.48
RF24_EN  (via drill 0.38)
  Top 0.203: U3.52 22.32,28.01 21.69,27.38 21.69,26.98 22.91,25.76 v23.52,25.76 | U1.1 33.02,26.82 31.14,28.7 v29.92,28.7
  Bottom 0.203: v23.52,25.76 23.52,24.74 23.93,24.33 27.58,24.33 29.21,25.96 29.21,27.99 v29.92,28.7
RF24_IRQ
  Top 0.203: U3.40 28.2,23.12 28.4,23.11 28.8,22.71 30.02,22.71 30.43,22.3 32.26,22.3 32.46,22.5 32.93,22.5 U1.6
RF24_MISO  (via drill 0.38)
  Top 0.203: U1.5 32.96,24.33 32.26,24.33 v31.45,23.52 30.63,24.33 30.63,25.35 29.21,26.77 29.21,29.36 30.84,30.99 30.84,32.51 | U9.2 30.39,33.92 30.84,33.48 30.84,32.51 | v29.21,21.29 28.54,20.62 U3.35 | U10.2 40.33,32.96 39.88,32.51 v38.61,32.51 | v32.77,34.54 32.77,33.78 31.5,32.51 30.84,32.51
  Bottom 0.203: v29.21,21.29 v31.45,23.52 | v38.61,32.51 34.8,32.51 v32.77,34.54
RF24_MOSI  (via drill 0.38)  (1 unrouted)
  Top 0.203: U1.4 32.98,24.94 31.85,24.94 v31.45,24.54 | v27.38,21.49 27.01,21.12 U3.36 | U10.5 39.03,29.75 37.41,31.37 34.21,31.37 v33.88,31.04
  Bottom 0.203: v33.88,31.04 31.45,28.6 31.45,26.77 31.04,26.37 31.04,24.13 | v27.38,21.49 28.4,21.49 31.04,24.13 | 31.04,24.13 v31.45,24.54
RF24_SCK  (via drill 0.38)  (1 unrouted)
  Top 0.203: U1.3 32.05,25.4 v31.85,25.6 | U3.34 29.26,20.12 v30.63,21.49 29.82,22.3 v27.99,22.3 | U10.6 39.68,29.92 36.96,32.64 34.67,32.64 v33.68,31.65
  Bottom 0.203: v30.63,21.49 32.46,23.32 32.46,24.99 v31.85,25.6 | v33.68,31.65 31.04,29.01 31.04,26.98 30.63,26.57 30.63,24.94 v27.99,22.3
RST
  Top 0.203: U$1.7 22.55,35.25 22.1,34.8 20.83,34.8 19.56,36.07 18.79,36.07 R3.1 C12.1 14.54,36.16 S1.3 13.69,35.31 8.64,35.31 6.1,32.77 6.1,23.37 6.86,22.61 11.68,22.61 13.2,24.12 U3.7
SRAM_CS  (via drill 0.38)
  Top 0.203: U10.1 40.98,32.45 v40.34,31.8 | v31.85,34.09 31.85,34.7 30.43,36.12 27.99,36.12 v27.38,35.51 | v22.61,30.23 22.3,30.23 21.82,29.74 U3.53
  Bottom 0.203: v40.34,31.8 34.14,31.8 v31.85,34.09 | v27.38,35.51 22.61,30.73 v22.61,30.23
T0  (via drill 0.38)
  Top 0.203: v19.66,31.45 19.32,31.1 U3.58
  Bottom 0.203: T0.P$1 24.13,46.89 20.47,43.23 20.47,32.26 v19.66,31.45
T1  (via drill 0.38)
  Top 0.203: v19.3,32.51 18.82,32.02 U3.59
  Bottom 0.203: T1.P$1 21.59,45.16 19.86,43.43 19.86,33.07 v19.3,32.51
T2  (via drill 0.38)
  Top 0.203: v18.03,27.79 17.82,28.01 U3.61
  Bottom 0.203: v18.03,27.79 15.19,30.63 15.19,46.51 T2.P$1
T3  (via drill 0.38)
  Top 0.203: U3.62 17.32,28.29 16.81,27.79 v16.61,27.79
  Bottom 0.203: v16.61,27.79 16.61,28.6 14.78,30.43 14.78,43.77 T3.P$1
TA0
  Top 0.203: U3.22 18.82,16.58 13.63,11.39 TA0.P$1
TA1
  Top 0.203: U3.23 19.32,16.47 12.44,9.59 TA1.P$1
V+
  Top 0.203: 32.97,11.4 32.97,11 JP6.2 35.2,8.76 35.2,8.53 | 30.29,14.1 30.24,14.15 | 29.97,16.97 29.97,17.64 U8.1
  Top 0.305: JP6.2 33.89,10.51
  Top 0.406: RN1.4 29.9,13.9 R1.2 | U8.1 31.3,17.46 LED1.A LED2.A 30.06,19.3 U8.3 | R1.2 30.03,13.84 30.29,14.1
  Top 0.61: BAT.P$1 32.51,3.3 32.51,5.84 35.2,8.53
  Top 1.016: 32.97,11.4 32.88,11.49 32.88,12.68 31.73,13.84 R1.2 | R1.2 | R1.2 C20.1 29.95,16.74 29.97,16.97